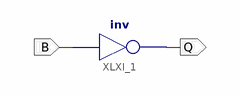
[diagram p0: schematic sheet 1]
// Xilinx ISE schematic lab7_A0.sch (spartan3e) as structural Verilog: 1 symbols, 2 ports
module lab7_A0 (
  input  B,
  output Q
);

  not XLXI_1 (Q, B);
endmodule
